# EAGLE design superDuino1 (EAGLE 7.1.0)
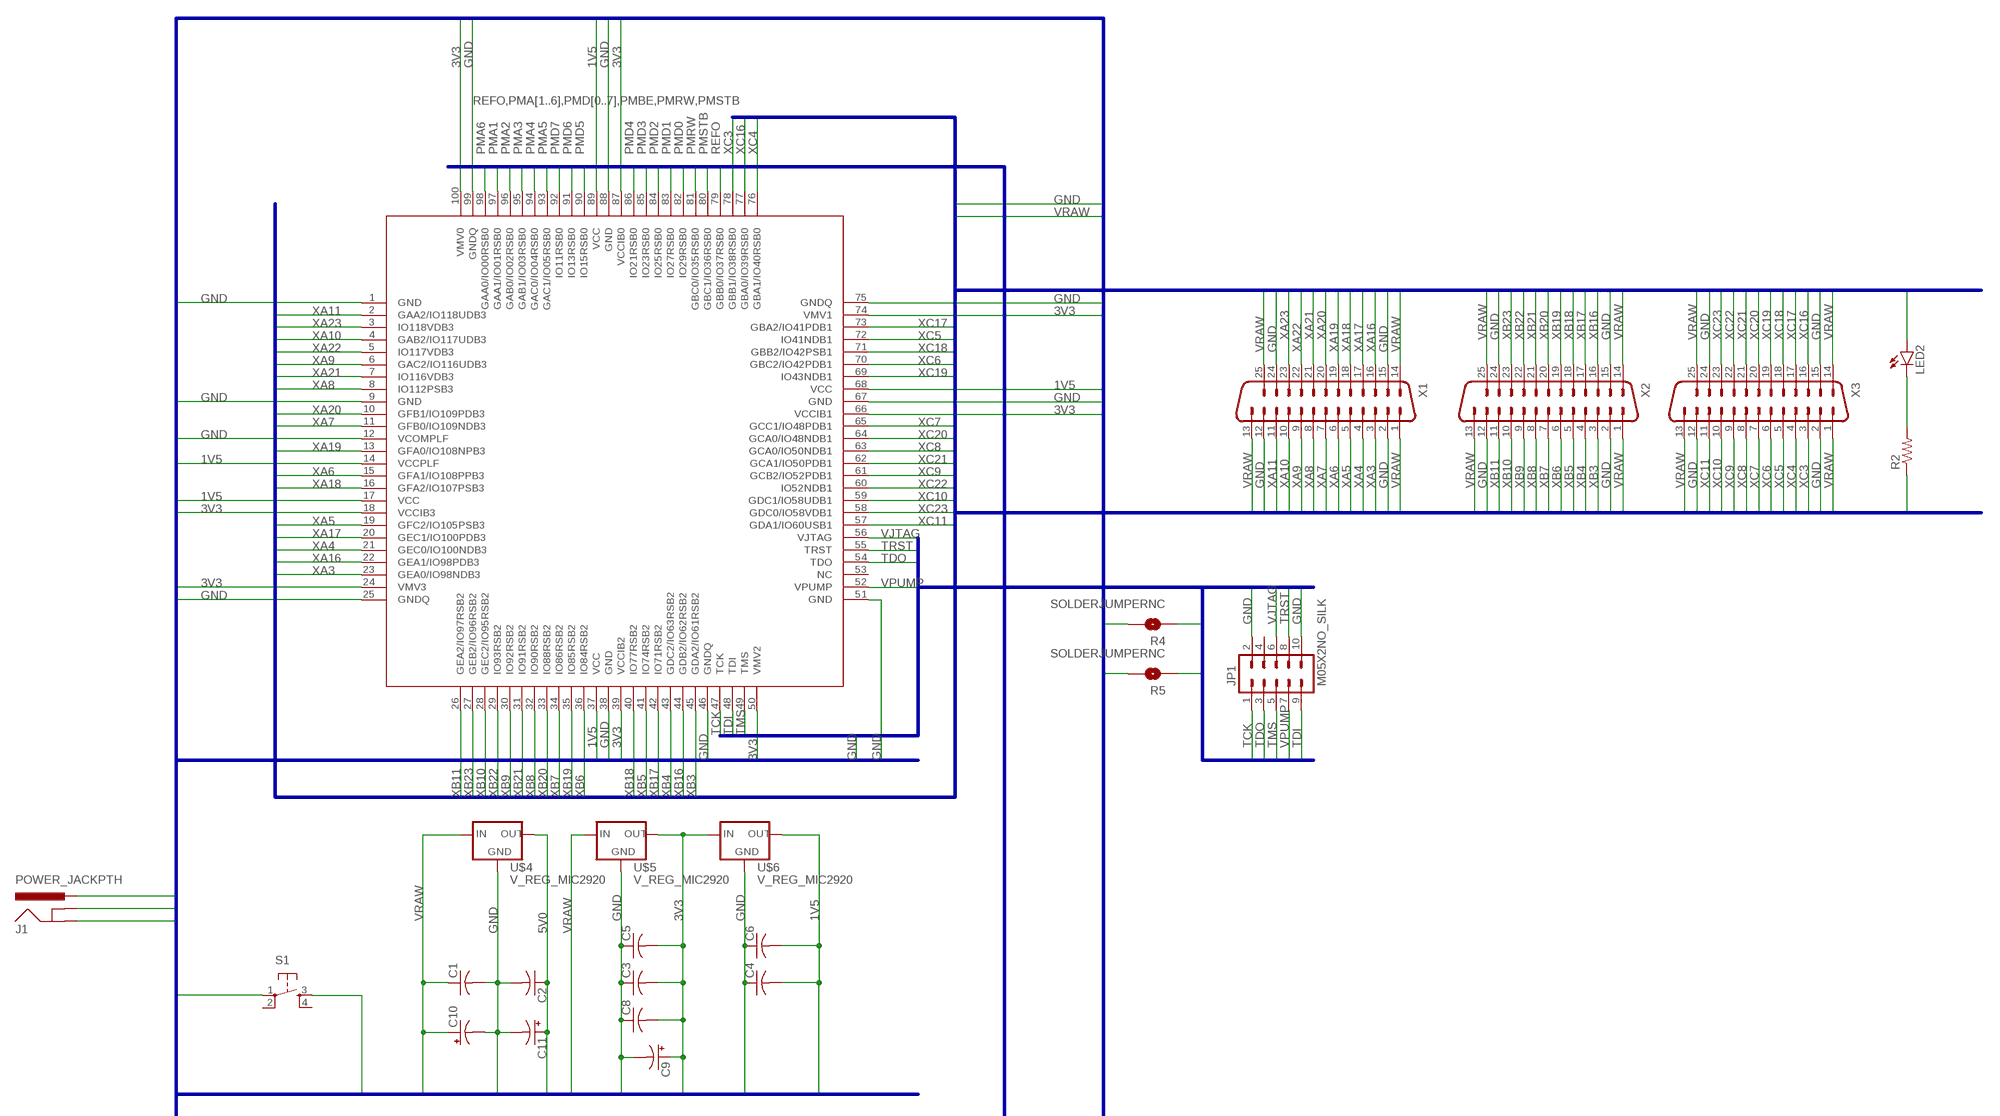
[diagram p0: schematic, sheet 1, part 1 of 2]
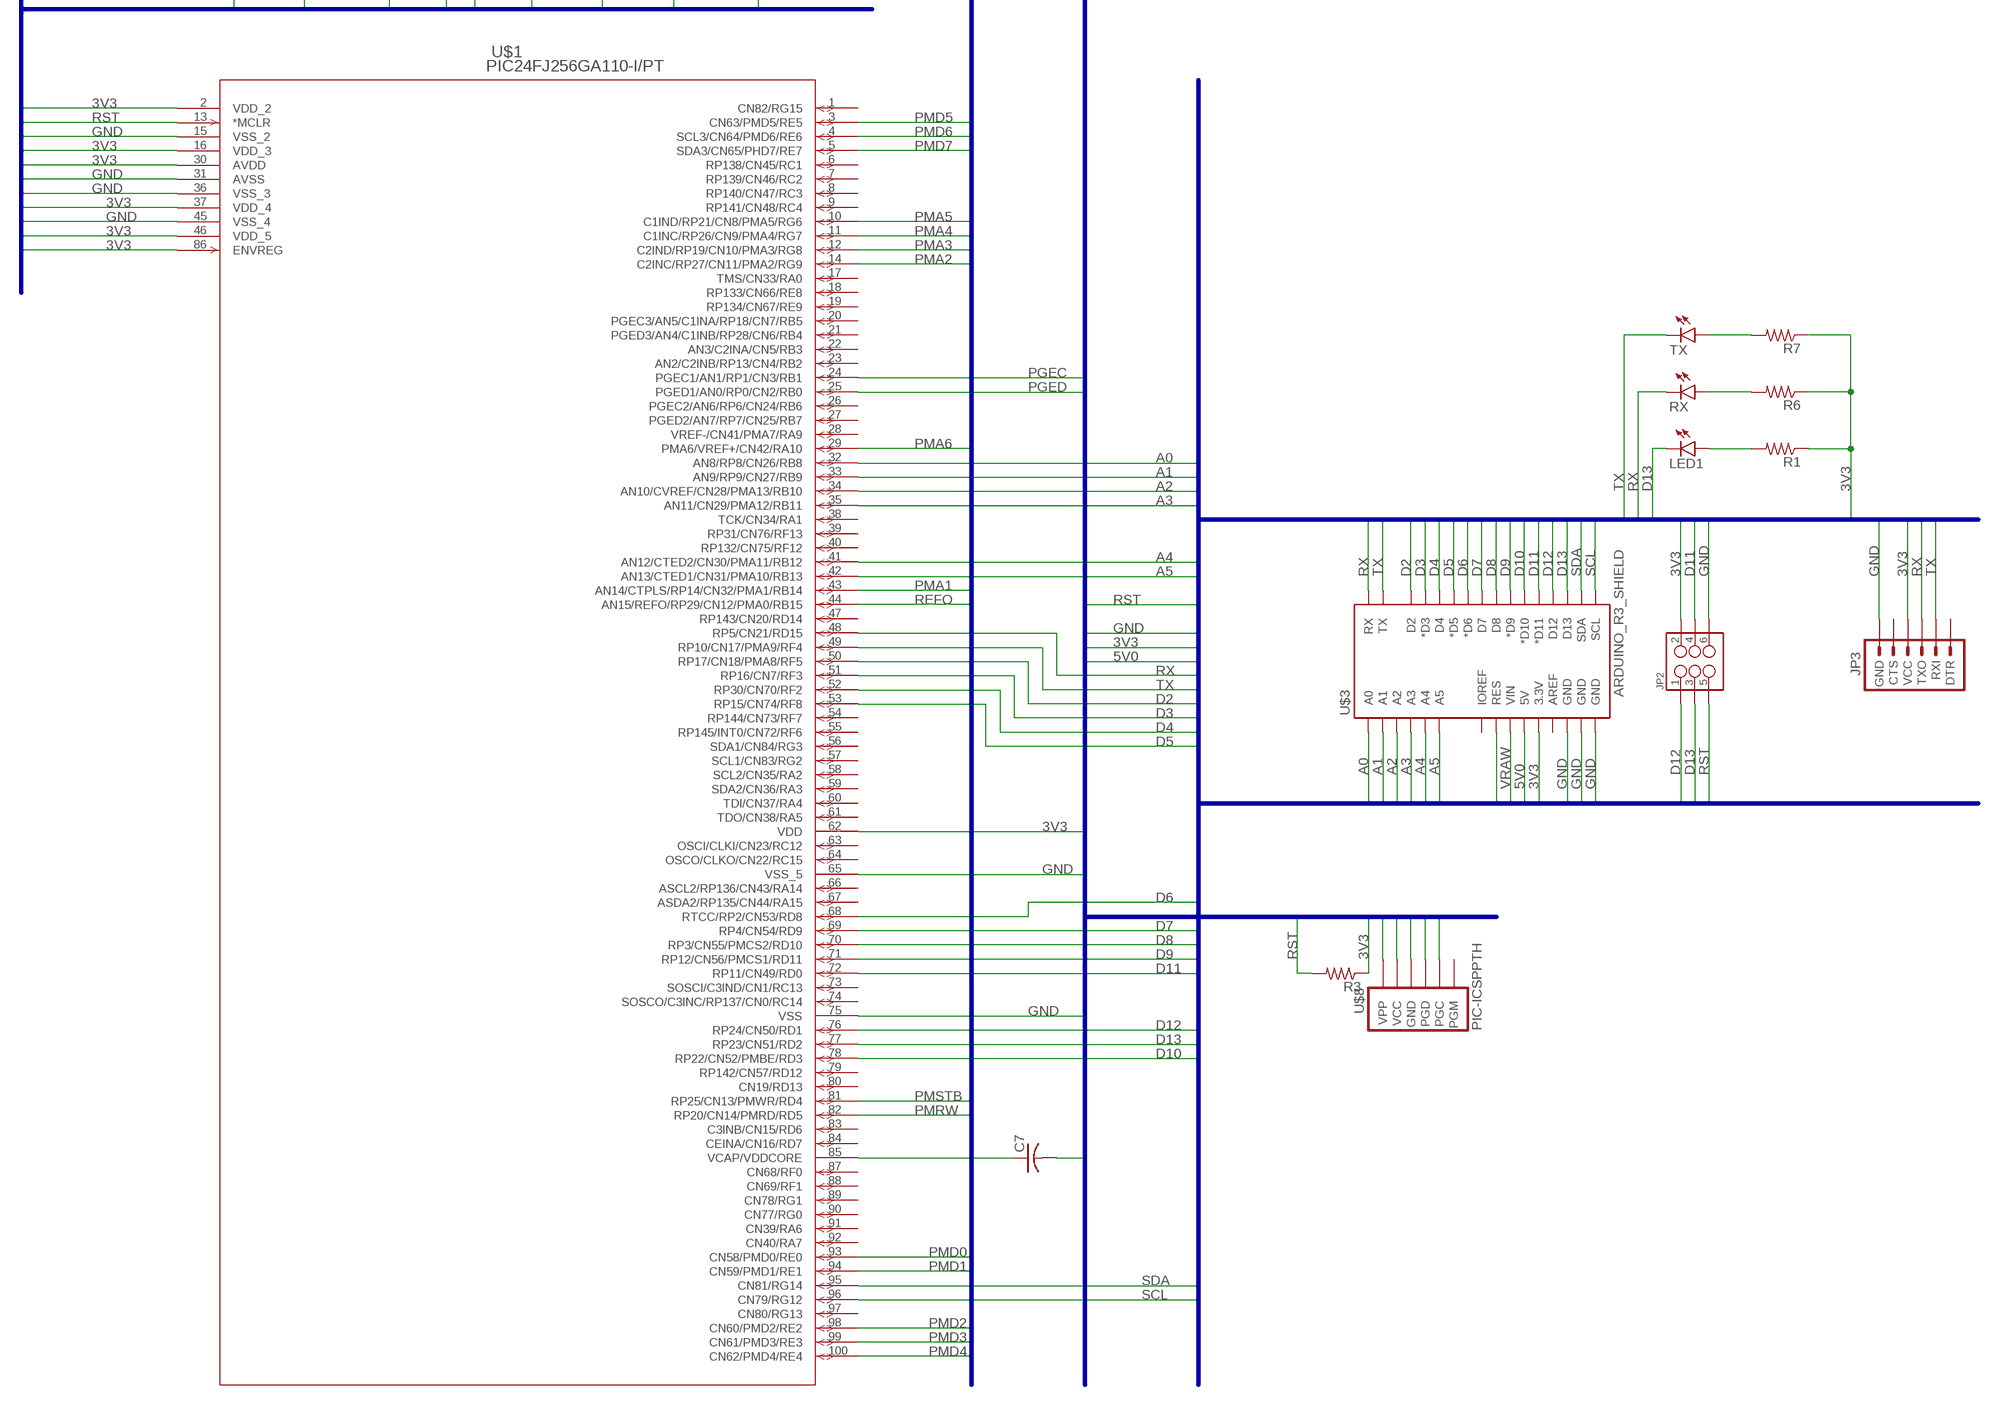
[diagram p1: schematic, sheet 1, part 2 of 2]

## Parts
C1  C-USC0805  [C0805]
C2  C-USC0805  [C0805]
C3  C-USC0805  [C0805]
C4  C-USC0805  [C0805]
C5  C-USC0805  [C0805]
C6  C-USC0805  [C0805]
C7  C-US050-035X075  [C050-035X075]
C8  C-USC0805  [C0805]
C9  CPOL-USE2.5-6  [E2,5-6]
C10  CPOL-USE2.5-6  [E2,5-6]
C11  CPOL-USE2.5-6  [E2,5-6]
J1  POWER_JACKPTH  [POWER_JACK_PTH]
JP1  M05X2NO_SILK  [2X5_NOSILK]
JP2  M03X22X3_SILK_SM  [2X3]
JP3  ARDUINO_SERIAL_PROGRAMPTH  [1X06]
LED1  LED1206  [LED-1206]
LED2  LED1206  [LED-1206]
R1  R-US_R0805  [R0805]
R2  R-US_R0805  [R0805]
R3  R-US_R0805  [R0805]
R4  SOLDERJUMPERNC  [SJ_2S]
R5  SOLDERJUMPERNC  [SJ_2S]
R6  R-US_R0805  [R0805]
R7  R-US_R0805  [R0805]
RX  LED1206  [LED-1206]
S1  TAC_SWITCHPTH  [TACTILE-PTH]
TX  LED1206  [LED-1206]
U$1  PIC24FJ256GA110-I/PT  [TQFP100_12X12MC]
U$2  A3P250-VQ100  [VQ100]
U$3  ARDUINO_R3_SHIELD  [UNO_R3_SHIELD]
U$4  V_REG_MIC2920  [SOT223]
U$5  V_REG_MIC2920  [SOT223]
U$6  V_REG_MIC2920  [SOT223]
U$8  PIC-ICSPPTH  [MOLEX-1X6]
X1  DB25H  [M25H]
X2  DB25H  [M25H]
X3  DB25H  [M25H]

## Nets
1V5: C4.2 C6.2 U$2.14(VCCPLF) U$2.17(VCC) U$2.37(VCC) U$2.68(VCC) U$2.89(VCC) U$6.3(OUT)
3V3: C3.2 C5.2 C8.2 C9.+ JP2.2 JP3.VCC R1.1 R3.1 R4.2 R5.2 R6.1 R7.1 U$1.2(VDD_2) U$1.16(VDD_3) U$1.30(AVDD) U$1.37(VDD_4) U$1.46(VDD_5) U$1.62(VDD) U$1.86(ENVREG) U$2.18(VCCIB3) U$2.24(VMV3) U$2.39(VCCIB2) U$2.50(VMV2) U$2.66(VCCIB1) U$2.74(VMV1) U$2.87(VCCIB0) U$2.100(VMV0) U$3.3.3V U$5.3(OUT) U$6.1(IN) U$8.5(VCC)
5V0: C2.1 C11.+ U$3.5V U$4.3(OUT)
A0: U$1.32(AN8/RP8/CN26/RB8) U$3.A0
A1: U$1.33(AN9/RP9/CN27/RB9) U$3.A1
A2: U$1.34(AN10/CVREF/CN28/PMA13/RB10) U$3.A2
A3: U$1.35(AN11/CN29/PMA12/RB11) U$3.A3
A4: U$1.41(AN12/CTED2/CN30/PMA11/RB12) U$3.A4
A5: U$1.42(AN13/CTED1/CN31/PMA10/RB13) U$3.A5
D2: U$1.50(RP17/CN18/PMA8/RF5) U$3.D2
D3: U$1.51(RP16/CN7/RF3) U$3.D3(*D3)
D4: U$1.52(RP30/CN70/RF2) U$3.D4
D5: U$1.53(RP15/CN74/RF8) U$3.D5(*D5)
D6: U$1.68(RTCC/RP2/CN53/RD8) U$3.D6(*D6)
D7: U$1.69(RP4/CN54/RD9) U$3.D7
D8: U$1.70(RP3/CN55/PMCS2/RD10) U$3.D8
D9: U$1.71(RP12/CN56/PMCS1/RD11) U$3.D9(*D9)
D10: U$1.78(RP22/CN52/PMBE/RD3) U$3.D10(*D10)
D11: JP2.4 U$1.72(RP11/CN49/RD0) U$3.D11(*D11)
D12: JP2.1 U$1.76(RP24/CN50/RD1) U$3.D12
D13: JP2.3 LED1.C U$1.77(RP23/CN51/RD2) U$3.D13
GND: C1.2 C2.2 C3.1 C4.1 C5.1 C6.1 C7.2 C8.1 C9.- C10.- C11.- J1.GND J1.GNDBREAK JP1.2 JP1.10 JP2.6 JP3.GND R2.1 S1.1 U$1.15(VSS_2) U$1.31(AVSS) U$1.36(VSS_3) U$1.45(VSS_4) U$1.65(VSS_5) U$1.75(VSS) U$2.1(GND) U$2.9(GND) U$2.12(VCOMPLF) U$2.25(GNDQ) U$2.38(GND) U$2.46(GNDQ) U$2.51(GND) U$2.67(GND) U$2.75(GNDQ) U$2.88(GND) U$2.99(GNDQ) U$3.GND@0(GND) U$3.GND@1(GND) U$3.GND@2(GND) U$4.2(GND) U$5.2(GND) U$6.2(GND) U$8.4(GND) X1.2 X1.12 X1.15 X1.24 X2.2 X2.12 X2.15 X2.24 X3.2 X3.12 X3.15 X3.24
N$1: LED1.A R1.2
N$2: C7.1 U$1.85(VCAP/VDDCORE)
N$3: LED2.C R2.2
N$4: R7.2 TX.A
N$5: R6.2 RX.A
PGEC: U$1.24(PGEC1/AN1/RP1/CN3/RB1) U$8.2(PGC)
PGED: U$1.25(PGED1/AN0/RP0/CN2/RB0) U$8.3(PGD)
PMA1: U$1.43(AN14/CTPLS/RP14/CN32/PMA1/RB14) U$2.97(GAA1/IO01RSB0)
PMA2: U$1.14(C2INC/RP27/CN11/PMA2/RG9) U$2.96(GAB0/IO02RSB0)
PMA3: U$1.12(C2IND/RP19/CN10/PMA3/RG8) U$2.95(GAB1/IO03RSB0)
PMA4: U$1.11(C1INC/RP26/CN9/PMA4/RG7) U$2.94(GAC0/IO04RSB0)
PMA5: U$1.10(C1IND/RP21/CN8/PMA5/RG6) U$2.93(GAC1/IO05RSB0)
PMA6: U$1.29(PMA6/VREF+/CN42/RA10) U$2.98(GAA0/IO00RSB0)
PMD0: U$1.93(CN58/PMD0/RE0) U$2.82(IO29RSB0)
PMD1: U$1.94(CN59/PMD1/RE1) U$2.83(IO27RSB0)
PMD2: U$1.98(CN60/PMD2/RE2) U$2.84(IO25RSB0)
PMD3: U$1.99(CN61/PMD3/RE3) U$2.85(IO23RSB0)
PMD4: U$1.100(CN62/PMD4/RE4) U$2.86(IO21RSB0)
PMD5: U$1.3(CN63/PMD5/RE5) U$2.90(IO15RSB0)
PMD6: U$1.4(SCL3/CN64/PMD6/RE6) U$2.91(IO13RSB0)
PMD7: U$1.5(SDA3/CN65/PHD7/RE7) U$2.92(IO11RSB0)
PMRW: U$1.82(RP20/CN14/PMRD/RD5) U$2.81(GBC0/IO35RSB0)
PMSTB: U$1.81(RP25/CN13/PMWR/RD4) U$2.80(GBC1/IO36RSB0)
REFO: U$1.44(AN15/REFO/RP29/CN12/PMA0/RB15) U$2.79(GBB0/IO37RSB0)
RST: JP2.5 R3.2 S1.3 U$1.13(*MCLR) U$3.RES U$8.6(VPP)
RX: JP3.TXO RX.C U$1.48(RP5/CN21/RD15) U$3.RX
SCL: U$1.96(CN79/RG12) U$3.SCL
SDA: U$1.95(CN81/RG14) U$3.SDA
TCK: JP1.1 U$2.47(TCK)
TDI: JP1.9 U$2.48(TDI)
TDO: JP1.3 U$2.54(TDO)
TMS: JP1.5 U$2.49(TMS)
TRST: JP1.8 U$2.55(TRST)
TX: JP3.RXI TX.C U$1.49(RP10/CN17/PMA9/RF4) U$3.TX
VJTAG: JP1.6 R5.1 U$2.56(VJTAG)
VPUMP: JP1.7 R4.1 U$2.52(VPUMP)
VRAW: C1.1 C10.+ J1.PWR U$3.VIN U$4.1(IN) U$5.1(IN) X1.1 X1.13 X1.14 X1.25 X2.1 X2.13 X2.14 X2.25 X3.1 X3.13 X3.14 X3.25
XA3: U$2.23(GEA0/IO98NDB3) X1.3
XA4: U$2.21(GEC0/IO100NDB3) X1.4
XA5: U$2.19(GFC2/IO105PSB3) X1.5
XA6: U$2.15(GFA1/IO108PPB3) X1.6
XA7: U$2.11(GFB0/IO109NDB3) X1.7
XA8: U$2.8(IO112PSB3) X1.8
XA9: U$2.6(GAC2/IO116UDB3) X1.9
XA10: U$2.4(GAB2/IO117UDB3) X1.10
XA11: U$2.2(GAA2/IO118UDB3) X1.11
XA16: U$2.22(GEA1/IO98PDB3) X1.16
XA17: U$2.20(GEC1/IO100PDB3) X1.17
XA18: U$2.16(GFA2/IO107PSB3) X1.18
XA19: U$2.13(GFA0/IO108NPB3) X1.19
XA20: U$2.10(GFB1/IO109PDB3) X1.20
XA21: U$2.7(IO116VDB3) X1.21
XA22: U$2.5(IO117VDB3) X1.22
XA23: U$2.3(IO118VDB3) X1.23
XB3: U$2.45(GDA2/IO61RSB2) X2.3
XB4: U$2.43(GDC2/IO63RSB2) X2.4
XB5: U$2.41(IO74RSB2) X2.5
XB6: U$2.36(IO84RSB2) X2.6
XB7: U$2.34(IO86RSB2) X2.7
XB8: U$2.32(IO90RSB2) X2.8
XB9: U$2.30(IO92RSB2) X2.9
XB10: U$2.28(GEC2/IO95RSB2) X2.10
XB11: U$2.26(GEA2/IO97RSB2) X2.11
XB16: U$2.44(GDB2/IO62RSB2) X2.16
XB17: U$2.42(IO71RSB2) X2.17
XB18: U$2.40(IO77RSB2) X2.18
XB19: U$2.35(IO85RSB2) X2.19
XB20: U$2.33(IO88RSB2) X2.20
XB21: LED2.A U$2.31(IO91RSB2) X2.21
XB22: U$2.29(IO93RSB2) X2.22
XB23: U$2.27(GEB2/IO96RSB2) X2.23
XC3: U$2.78(GBB1/IO38RSB0) X3.3
XC4: U$2.76(GBA1/IO40RSB0) X3.4
XC5: U$2.72(IO41NDB1) X3.5
XC6: U$2.70(GBC2/IO42PDB1) X3.6
XC7: U$2.65(GCC1/IO48PDB1) X3.7
XC8: U$2.63(GCA0/IO50NDB1) X3.8
XC9: U$2.61(GCB2/IO52PDB1) X3.9
XC10: U$2.59(GDC1/IO58UDB1) X3.10
XC11: U$2.57(GDA1/IO60USB1) X3.11
XC16: U$2.77(GBA0/IO39RSB0) X3.16
XC17: U$2.73(GBA2/IO41PDB1) X3.17
XC18: U$2.71(GBB2/IO42PSB1) X3.18
XC19: U$2.69(IO43NDB1) X3.19
XC20: U$2.64(GCA0/IO48NDB1) X3.20
XC21: U$2.62(GCA1/IO50PDB1) X3.21
XC22: U$2.60(IO52NDB1) X3.22
XC23: U$2.58(GDC0/IO58VDB1) X3.23
Unconnected: JP1.4 JP3.CTS JP3.DTR S1.2 S1.4 U$1.1(CN82/RG15) U$1.6(RP138/CN45/RC1) U$1.7(RP139/CN46/RC2) U$1.8(RP140/CN47/RC3) U$1.9(RP141/CN48/RC4) U$1.17(TMS/CN33/RA0) U$1.18(RP133/CN66/RE8) U$1.19(RP134/CN67/RE9) U$1.20(PGEC3/AN5/C1INA/RP18/CN7/RB5) U$1.21(PGED3/AN4/C1INB/RP28/CN6/RB4) U$1.22(AN3/C2INA/CN5/RB3) U$1.23(AN2/C2INB/RP13/CN4/RB2) U$1.26(PGEC2/AN6/RP6/CN24/RB6) U$1.27(PGED2/AN7/RP7/CN25/RB7) U$1.28(VREF-/CN41/PMA7/RA9) U$1.38(TCK/CN34/RA1) U$1.39(RP31/CN76/RF13) U$1.40(RP132/CN75/RF12) U$1.47(RP143/CN20/RD14) U$1.54(RP144/CN73/RF7) U$1.55(RP145/INT0/CN72/RF6) U$1.56(SDA1/CN84/RG3) U$1.57(SCL1/CN83/RG2) U$1.58(SCL2/CN35/RA2) U$1.59(SDA2/CN36/RA3) U$1.60(TDI/CN37/RA4) U$1.61(TDO/CN38/RA5) U$1.63(OSCI/CLKI/CN23/RC12) U$1.64(OSCO/CLKO/CN22/RC15) U$1.66(ASCL2/RP136/CN43/RA14) U$1.67(ASDA2/RP135/CN44/RA15) U$1.73(SOSCI/C3IND/CN1/RC13) U$1.74(SOSCO/C3INC/RP137/CN0/RC14) U$1.79(RP142/CN57/RD12) U$1.80(CN19/RD13) U$1.83(C3INB/CN15/RD6) U$1.84(CEINA/CN16/RD7) U$1.87(CN68/RF0) U$1.88(CN69/RF1) U$1.89(CN78/RG1) U$1.90(CN77/RG0) U$1.91(CN39/RA6) U$1.92(CN40/RA7) U$1.97(CN80/RG13) U$2.53(NC) U$3.AREF U$3.IOREF U$8.1(PGM)

## Buses
REFO,PMA[1..6],PMD[0..7],PMBE,PMRW,PMSTB
PGEC,PGED,GND,VRAW,5V0,3V3,1V5,RST
TX,RX,D[2..13],A[0..5],VRAW,5V0,3V3,GND,RST,SDA,SCL
TCK,TDO,TMS,VPUMP,TDI,GND,VJTAG,TRST
GND,VRAW,XA[3..11],XA[16..23],XB[3..11],XB[16..23],XC[3..11],XC[16..23]

## Library data of the parts
C1-C8 = rcl:C-US: CAPACITOR, American symbol
C9-C11 = rcl:CPOL-US: POLARIZED CAPACITOR, American symbol
J1 = SparkFun-Connectors:POWER_JACK: Power Jack This is the standard 5.5mm barrel jack for power. The PTH is the most common, proven, reliable, footprint. The Slot footprint only works if the mill layer is transmitted to the PCB fab house so be warned. Mating wall wart : TOL-00298 (and others); PROD_ID: PRT-00119
JP1 = SparkFun-Connectors:M05X2: Header 5x2 Standard 10-pin dual row 0.1" header. Commonly used with AVR-ISP. Use with Spark Fun Electronics SKU: PRT-00778
JP2 = SparkFun-Connectors:M03X2: 2x3 .1" header. Shrouded, with keying- CONN-10681 SMT- CONN-11415 Pogo pins- HW-11044
JP3 = SparkFun-Connectors:ARDUINO_SERIAL_PROGRAM: FTDI connector footprints
LED1 LED2 RX TX = SparkFun-LED:LED: LEDs Standard schematic elements and footprints for 5mm, 3mm, 1206, and 0603 sized LEDs. 5mm - Spark Fun Electronics SKU : COM-00529 (and others)
R1-R3 R6 R7 = rcl:R-US_: RESISTOR, American symbol
R4 R5 = SparkFun-Retired:SOLDERJUMPER: Solder Jumper Standard SMD solder jumper. Used to automate production. Two varients : Normally Open and Normally Closed are the same, but have different paste layers. NC will have a large amount of paste and should jumper during reflow.
S1 = SparkFun-Electromechanical:TAC_SWITCH: Momentary Switch Button commonly used for reset or general input. Spark Fun Electronics SKU : COM-00097 SMT- SWCH-08247
U$1 = pic24fj256ga110:PIC24FJ256GA110-I/PT; COPYRIGHT: Copyright (C) 2015 Accelerated Designs. All rights reserved; MANUFACTURER_PART_NUMBER: PIC24FJ256GA110-I/PT; VENDOR: Microchip
U$2 = microsemi-a3p250:A3P250-VQ100
U$3 = SparkFun-Boards:ARDUINO_R3_SHIELD: Shield form compatible with the Arduino Uno R3.
U$4-U$6 = SparkFun-PowerIC:V_REG_MIC2920: MIC2920A (http://www.micrel.com/_PDF/mic2920.pdf) - 400mA output LDO Regulator
U$8 = SparkFun-Connectors:PIC-ICSP: ISCP Programming connector for UAV, UBW Kit, etc.
X1-X3 = SparkFun-Connectors:DB25: Various DB25 connectors

## Board
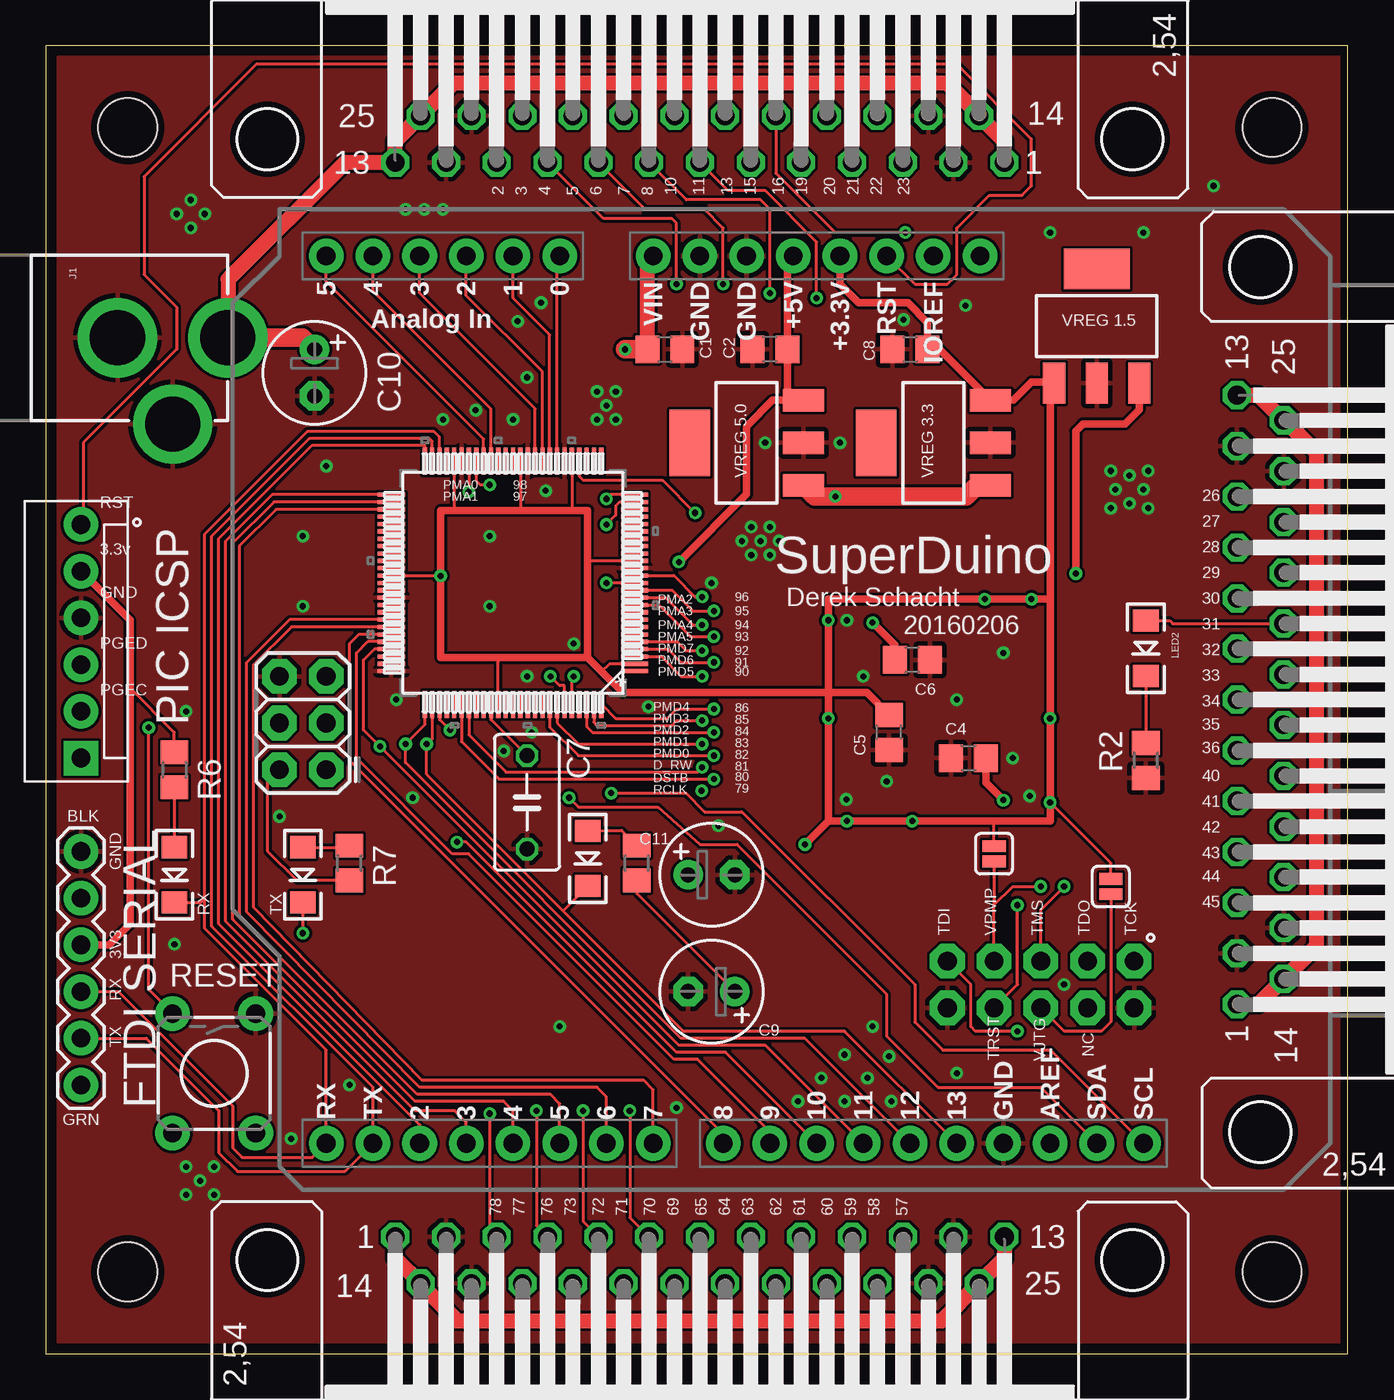
[diagram p2: board, top side]
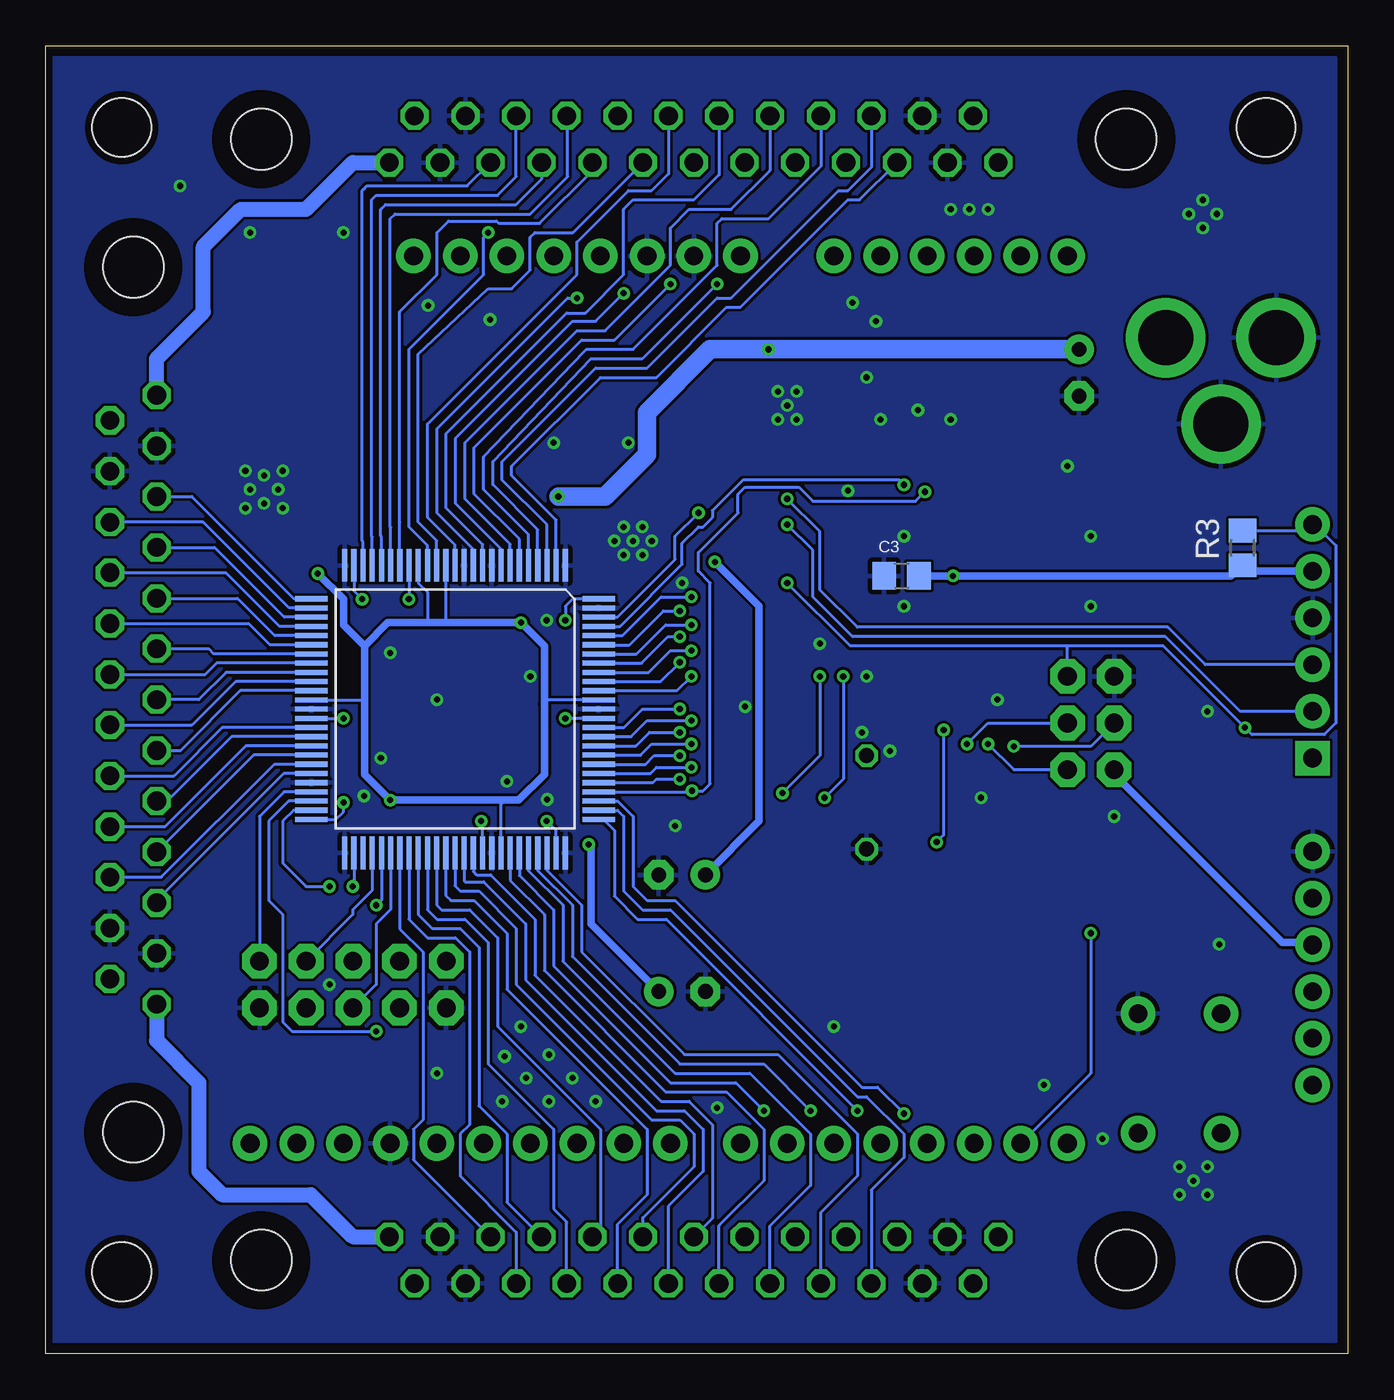
[diagram p3: board, bottom side, seen from below]

Size 70.79 x 71.11 mm. Coordinates in mm from the lower left corner, seen from the top.
Outline: 0,0 70.79,0 70.79,71.11 0,71.11 0,0
Copper layers (1*16): Top 0.0356mm / dielectric 1.5011mm / Bottom 0.0356mm
Design rules "LaenPCBOrder": minimum track width 6mil, minimum drill 13mil, track to track 6mil, track to pad 6mil, pad to pad 6mil, via to via 6mil, smd to smd 6mil, copper to edge 15mil, drill to drill 6mil, minimum pad ring 7mil, minimum via ring 7mil, stop-mask expansion 3mil, vias tented up to drill 0mil, thermal gap 10mil
Holes 3.2 mm at 4.45,66.67 66.67,66.67 66.67,4.45 4.45,4.45

### Footprints (pad centres in the part's own frame; a part is rotated, then mirrored left to right if it is on the bottom)
C0805 = smd 1.3 x 1.5: 1 -0.95,0; 2 0.95,0
C050-035X075 = drill 0.813 octagon: 1 -2.54,0; 2 2.54,0
E2,5-6 = drill 0.813 pad 1.6: + -1.27,0 | drill 0.813 pad 1.6 octagon: - 1.27,0
POWER_JACK_PTH = drill 2.997 pad 4.318: GND 0,7.7; GNDBREAK 4.7,10.7; PWR 0,13.7
2X5_NOSILK = drill 1.016 pad 1.88 octagon: 1 -1.27,5.08; 2 1.27,5.08; 3 -1.27,2.54; 4 1.27,2.54; 5 -1.27,0; 6 1.27,0; 7 -1.27,-2.54; 8 1.27,-2.54; 9 -1.27,-5.08; 10 1.27,-5.08
2X3 = drill 1.016 pad 1.88 octagon: 1 0,0; 2 0,2.54; 3 2.54,0; 4 2.54,2.54; 5 5.08,0; 6 5.08,2.54
1X06 = drill 1.016 pad 1.88: CTS 10.16,0; DTR 0,0; GND 12.7,0; RXI 2.54,0; TXO 5.08,0; VCC 7.62,0
LED-1206 = smd 1.2 x 1.4: A -1.5,0; C 1.5,0
R0805 = smd 1.3 x 1.5: 1 -0.95,0; 2 0.95,0
SJ_2S = smd 0.635 x 1.27: 1 -0.412,0; 2 0.412,0
TACTILE-PTH = drill 1.016 pad 1.88: 1 -3.251,2.261; 2 3.251,2.261; 3 -3.251,-2.261; 4 3.251,-2.261
TQFP100_12X12MC = smd 1.473 x 0.229: 1 -6.617,4.8; 2 -6.617,4.4; 3 -6.617,4; 4 -6.617,3.6; 5 -6.617,3.2; 6 -6.617,2.8; 7 -6.617,2.4; 8 -6.617,2; 9 -6.617,1.6; 10 -6.617,1.2; 11 -6.617,0.8; 12 -6.617,0.4; 13 -6.617,0; 14 -6.617,-0.4; 15 -6.617,-0.8; 16 -6.617,-1.2; 17 -6.617,-1.6; 18 -6.617,-2; 19 -6.617,-2.4; 20 -6.617,-2.8; 21 -6.617,-3.2; 22 -6.617,-3.6; 23 -6.617,-4; 24 -6.617,-4.4; 25 -6.617,-4.8; 51 6.617,-4.8; 52 6.617,-4.4; 53 6.617,-4; 54 6.617,-3.6; 55 6.617,-3.2; 56 6.617,-2.8; 57 6.617,-2.4; 58 6.617,-2; 59 6.617,-1.6; 60 6.617,-1.2; 61 6.617,-0.8; 62 6.617,-0.4; 63 6.617,0; 64 6.617,0.4; 65 6.617,0.8; 66 6.617,1.2; 67 6.617,1.6; 68 6.617,2; 69 6.617,2.4; 70 6.617,2.8; 71 6.617,3.2; 72 6.617,3.6; 73 6.617,4; 74 6.617,4.4; 75 6.617,4.8 | smd 0.229 x 1.473: 26 -4.8,-6.617; 27 -4.4,-6.617; 28 -4,-6.617; 29 -3.6,-6.617; 30 -3.2,-6.617; 31 -2.8,-6.617; 32 -2.4,-6.617; 33 -2,-6.617; 34 -1.6,-6.617; 35 -1.2,-6.617; 36 -0.8,-6.617; 37 -0.4,-6.617; 38 0,-6.617; 39 0.4,-6.617; 40 0.8,-6.617; 41 1.2,-6.617; 42 1.6,-6.617; 43 2,-6.617; 44 2.4,-6.617; 45 2.8,-6.617; 46 3.2,-6.617; 47 3.6,-6.617; 48 4,-6.617; 49 4.4,-6.617; 50 4.8,-6.617; 76 4.8,6.617; 77 4.4,6.617; 78 4,6.617; 79 3.6,6.617; 80 3.2,6.617; 81 2.8,6.617; 82 2.4,6.617; 83 2,6.617; 84 1.6,6.617; 85 1.2,6.617; 86 0.8,6.617; 87 0.4,6.617; 88 0,6.617; 89 -0.4,6.617; 90 -0.8,6.617; 91 -1.2,6.617; 92 -1.6,6.617; 93 -2,6.617; 94 -2.4,6.617; 95 -2.8,6.617; 96 -3.2,6.617; 97 -3.6,6.617; 98 -4,6.617; 99 -4.4,6.617; 100 -4.8,6.617
VQ100 = smd 1.778 x 0.279: 1 -0.318,0; 2 -0.318,-0.5; 3 -0.318,-1; 4 -0.318,-1.5; 5 -0.318,-2; 6 -0.318,-2.5; 7 -0.318,-3; 8 -0.318,-3.5; 9 -0.318,-4; 10 -0.318,-4.5; 11 -0.318,-5; 12 -0.318,-5.5; 13 -0.318,-6; 14 -0.318,-6.5; 15 -0.318,-7; 16 -0.318,-7.5; 17 -0.318,-8; 18 -0.318,-8.5; 19 -0.318,-9; 20 -0.318,-9.5; 21 -0.318,-10; 22 -0.318,-10.5; 23 -0.318,-11; 24 -0.318,-11.5; 25 -0.318,-12; 51 15.318,-12; 52 15.318,-11.5; 53 15.318,-11; 54 15.318,-10.5; 55 15.318,-10; 56 15.318,-9.5; 57 15.318,-9; 58 15.318,-8.5; 59 15.318,-8; 60 15.318,-7.5; 61 15.318,-7; 62 15.318,-6.5; 63 15.318,-6; 64 15.318,-5.5; 65 15.318,-5; 66 15.318,-4.5; 67 15.318,-4; 68 15.318,-3.5; 69 15.318,-3; 70 15.318,-2.5; 71 15.318,-2; 72 15.318,-1.5; 73 15.318,-1; 74 15.318,-0.5; 75 15.318,0 | smd 0.279 x 1.778: 26 1.5,-13.818; 27 2,-13.818; 28 2.5,-13.818; 29 3,-13.818; 30 3.5,-13.818; 31 4,-13.818; 32 4.5,-13.818; 33 5,-13.818; 34 5.5,-13.818; 35 6,-13.818; 36 6.5,-13.818; 37 7,-13.818; 38 7.5,-13.818; 39 8,-13.818; 40 8.5,-13.818; 41 9,-13.818; 42 9.5,-13.818; 43 10,-13.818; 44 10.5,-13.818; 45 11,-13.818; 46 11.5,-13.818; 47 12,-13.818; 48 12.5,-13.818; 49 13,-13.818; 50 13.5,-13.818; 76 13.5,1.817; 77 13,1.817; 78 12.5,1.817; 79 12,1.817; 80 11.5,1.817; 81 11,1.817; 82 10.5,1.817; 83 10,1.817; 84 9.5,1.817; 85 9,1.817; 86 8.5,1.817; 87 8,1.817; 88 7.5,1.817; 89 7,1.817; 90 6.5,1.817; 91 6,1.817; 92 5.5,1.817; 93 5,1.817; 94 4.5,1.817; 95 4,1.817; 96 3.5,1.817; 97 3,1.817; 98 2.5,1.817; 99 2,1.817; 100 1.5,1.817
UNO_R3_SHIELD = drill 1.016 pad 1.88: 3.3V 50.8,26.67; 5V 50.8,29.21; A0 50.8,41.91; A1 50.8,44.45; A2 50.8,46.99; A3 50.8,49.53; A4 50.8,52.07; A5 50.8,54.61; AREF 2.54,15.24; D2 2.54,49.53; D3 2.54,46.99; D4 2.54,44.45; D5 2.54,41.91; D6 2.54,39.37; D7 2.54,36.83; D8 2.54,33.02; D9 2.54,30.48; D10 2.54,27.94; D11 2.54,25.4; D12 2.54,22.86; D13 2.54,20.32; GND@0 50.8,31.75; GND@1 50.8,34.29; GND@2 2.54,17.78; IOREF 50.8,21.59; NC 50.8,19.05; RES 50.8,24.13; RX 2.54,54.61; SCL 2.54,10.16; SDA 2.54,12.7; TX 2.54,52.07; VIN 50.8,36.83
SOT223 = smd 1.219 x 2.235: 1 -2.311,-3.099; 2 0,-3.099; 3 2.311,-3.099 | smd 3.6 x 2.2: 4 0,3.099
MOLEX-1X6 = drill 1.016 pad 1.88 square: 1 0,0 | drill 1.016 pad 1.88: 2 2.54,0; 3 5.08,0; 4 7.62,0; 5 10.16,0; 6 12.7,0
M25H = drill 1.016 octagon: 1 -16.561,1.27; 2 -13.792,1.27; 3 -11.049,1.27; 4 -8.28,1.27; 5 -5.512,1.27; 6 -2.769,1.27; 7 0,1.27; 8 2.769,1.27; 9 5.512,1.27; 10 8.28,1.27; 11 11.049,1.27; 12 13.792,1.27; 13 16.561,1.27; 14 -15.189,-1.27; 15 -12.421,-1.27; 16 -9.652,-1.27; 17 -6.909,-1.27; 18 -4.14,-1.27; 19 -1.372,-1.27; 20 1.372,-1.27; 21 4.14,-1.27; 22 6.909,-1.27; 23 9.652,-1.27; 24 12.421,-1.27; 25 15.189,-1.27 | hole 3.302: 23.52,0; -23.52,0

### Placement (x,y rotation side)
C1  33.66,54.61 0 top
C2  39.37,54.61 180 top
C3  24.26,42.29 0 bottom
C4  50.16,32.38 0 top
C5  45.85,33.78 90 top
C6  47.12,37.72 180 top
C7  26.16,29.97 270 top
C8  46.99,54.61 0 top
C9  36.2,19.68 180 top
C10  14.61,53.34 270 top
C11  36.2,26.04 0 top
J1  -3.81,55.24 270 top
JP1  54.1,20.07 270 top
JP2  15.24,31.75 90 top
JP3  1.91,14.61 90 top
LED1  29.46,26.92 270 top
LED2  59.82,38.35 270 top
R1  32.13,26.67 90 top
R2  59.82,32.26 90 top
R3  5.71,43.81 90 bottom
R4  51.56,27.18 90 top
R5  57.91,25.4 90 top
R6  6.99,31.75 270 top
R7  16.51,26.67 90 top
RX  6.99,26.04 270 top
S1  9.14,15.24 270 top
TX  13.97,26.04 270 top
U$1  25.4,41.91 180 top
U$2  42.55,42.55 270 bottom
U$3  69.85,8.89 90 top
U$4  38.1,49.53 90 top
U$5  48.26,49.53 90 top
U$6  57.15,55.88 0 top
U$8  1.91,32.38 90 top
X1  35.56,66.04 180 top
X2  66.04,35.56 90 top
X3  35.56,5.08 0 top

### Tracks (layer width: path | path; a pad name or v marks a point on that pad's centre or on a via)
1V5  (via drill 0.33)
  Top 0.406: C6.2 46.17,38.54 v44.96,39.75 | C4.2 51.12,31.05 v52.07,30.1 | U$6.3 59.46,51.33 58.67,50.55 56.39,50.55 56.01,50.16 v56.01,42.42
  Bottom 0.152: U$2.14 49.05,39.77 49.02,39.75 | U$2.37 53.58,35.55 53.47,35.43 | U$2.89 43.45,35.55 43.69,35.31 | U$2.68 46.05,29.9 45.85,30.1 | U$2.17 50.55,41.91 50.04,41.4 50.04,39.88 50.16,39.75
  Bottom 0.406: 53.47,38.48 53.47,35.43 53.47,31.5 v52.07,30.1 45.85,30.1 45.09,30.1 43.69,31.5 43.69,35.31 43.69,38.48 v44.96,39.75 49.02,39.75 50.16,39.75 52.2,39.75 53.47,38.48 | v56.01,42.42 54.61,41.02 54.61,39.62 53.47,38.48
3V3  (via drill 0.33)
  Top 0.152: U$1.2 30.65,37.51 30.23,37.08 | U$1.16 29.53,43.11 29.46,43.18 | U$1.30 28.6,45.95 28.7,45.85 | U$1.46 22.2,45.87 22.23,45.85 | U$1.62 21.32,42.31 21.46,42.16 | U$1.86 24.6,37.63 24.38,37.85 | U$1.37 25.8,45.87 25.78,45.85 | R1.1 32.13,25.02 C9.+ | R5.2 57.91,26.67 v54.61,29.97 | R4.2 51.56,28.96 | R6.1 6.99,33.78 4.57,36.2 | R7.1 13.65,25.72 12.06,27.3 12.06,31.11 JP2.2
  Top 0.406: 42.55,35.94 31.37,35.94 30.23,37.08 29.46,37.85 | 29.46,37.85 29.46,43.18 29.46,45.85 28.7,45.85 25.78,45.85 22.23,45.85 21.46,45.85 v21.46,42.29 21.46,42.16 21.46,37.85 24.38,37.85 29.46,37.85 | 42.55,35.94 v42.55,39.88 42.55,41.02 v51.05,41.02 v53.59,41.02 54.61,41.02 | 54.61,41.02 v54.61,34.54 v54.61,29.97 54.61,28.96 51.56,28.96 v47.12,28.96 v43.56,28.96 42.55,28.96 | 42.55,28.96 v42.55,34.54 42.55,35.94 | 42.55,35.94 44.64,35.94 C5.2 | v41.27,27.69 42.55,28.96 | 54.79,52.83 U$6.1 | 54.48,52.83 53.59,52.83 52.6,51.84 U$5.3 48.59,54.61 C8.2 47.94,56.07 46.86,57.15 44.2,57.15 43.18,58.17 U$3.3.3V | 54.61,52.83 54.79,52.83 | 54.79,52.83 54.86,52.83 | 55.12,52.83 54.86,52.83 | 54.86,52.83 54.74,52.7 54.61,52.7 54.48,52.83 | 54.48,52.83 54.61,52.83 | 54.61,52.83 54.61,41.02 | JP3.VCC 3.43,22.23 4.57,23.37 4.57,36.2 4.57,39.88 U$8.5
  Bottom 0.152: U$2.39 v54.61,34.55 v54.61,34.54 | U$2.50 55.03,29.05 54.61,29.46 v54.61,29.97 | U$2.74 43.05,28.44 v43.56,28.96 | U$2.66 47.05,28.88 v47.12,28.96 | U$2.100 42.14,41.05 42.55,40.64 v42.55,39.88 | U$2.87 v42.54,34.55 v42.55,34.54 | U$2.18 v51.05,41.03 v51.05,41.02 | U$2.24 54.05,41.47 v53.59,41.02
  Bottom 0.406: U$8.5 5.39,42.55 R3.1 5.78,42.87 6.35,42.29 v21.46,42.29 C3.2 | JP2.2 12.7,31.5 3.56,22.35 2.03,22.35 JP3.VCC | C9.+ 41.15,23.37 41.15,27.56 v41.27,27.69
5V0  (via drill 0.33)
  Top 0.406: U$4.3 40.13,51.84 | 40.13,51.84 39.52,51.84 38.1,50.42 38.1,46.74 v34.42,43.05 | 40.13,51.84 40.32,52.03 C2.1 40.32,59.37 U$3.5V
  Bottom 0.406: C11.+ 32,28.96 32,40.64 v34.42,43.05
A0
  Top 0.152: U$1.32 27.8,59.55 U$3.A0
A1
  Top 0.152: U$1.33 27.4,55.4 25.4,57.4 U$3.A1
A2
  Top 0.152: U$1.34 27,53.39 22.86,57.53 U$3.A2
A3
  Top 0.152: U$1.35 26.6,51.38 20.32,57.66 U$3.A3
A4
  Top 0.152: U$1.41 24.2,51.37 17.78,57.78 U$3.A4
A5
  Top 0.152: U$1.42 23.8,49.73 15.24,58.29 U$3.A5
D2
  Top 0.152: U$3.D2 20.32,12.45 9.4,23.37 9.4,44.32 14.48,49.4 20.59,49.4 U$1.50
D3
  Top 0.152: U$3.D3 22.86,12.57 22.23,13.21 20.07,13.21 9.78,23.5 9.78,44.2 12.29,46.71 U$1.51
D4
  Top 0.152: U$3.D4 25.4,13.21 24.89,13.72 20.07,13.72 10.16,23.62 10.16,44.07 12.4,46.31 U$1.52
D5
  Top 0.152: U$3.D5 27.94,13.59 27.43,14.1 20.19,14.1 10.54,23.75 10.54,43.94 12.51,45.91 U$1.53
D6
  Top 0.152: U$3.D6 30.48,13.97 29.97,14.48 20.32,14.48 10.92,24 10.92,37.59 13.24,39.91 U$1.68
D7
  Top 0.152: U$3.D7 33.02,14.35 32.51,14.86 20.45,14.86 11.3,24.26 11.3,37.47 13.35,39.51 U$1.69
D8
  Top 0.152: U$3.D8 36.83,11.94 16.51,32.26 16.51,38.61 17.02,39.12 U$1.70
D9
  Top 0.152: U$3.D9 39.37,12.06 35.43,16 34.16,16 22.99,27.18 22.1,27.18 16.89,32.38 16.89,38.1 17.5,38.71 U$1.71
D10  (via drill 0.33)
  Top 0.152: U$3.D10 36.96,16.38 34.29,16.38 22.86,27.81 v22.35,27.81 | 21.8,34.08 v21.97,33.91 21.4,34.48 U$1.78
  Bottom 0.152: v21.97,33.91 21.97,28.19 v22.35,27.81
D11  (via drill 0.33)
  Top 0.152: U$3.D11 39.12,16.76 34.42,16.76 v18.16,33.02 17.27,33.91 17.27,37.72 17.86,38.31 U$1.72
  Bottom 0.152: JP2.4 13.97,33.02 v18.16,33.02
D12  (via drill 0.33)
  Top 0.152: U$3.D12 41.27,17.14 34.54,17.14 19.56,32.13 v19.56,33.15 20.6,34.19 U$1.76
  Bottom 0.152: v19.56,33.15 18.16,31.75 JP2.1
D13  (via drill 0.33)
  Top 0.152: U$3.D13 43.43,17.53 34.67,17.53 28.13,24.07 | U$1.77 21,33.45 v20.7,33.15 20.7,31.5 28.13,24.07 | LED1.C 29.46,25.4 28.13,24.07
  Bottom 0.152: v20.7,33.15 19.56,34.29 JP2.3
GND  (via drill 0.33)
  other vias: 43.56,39.88 53.5,30.32 43.53,30.13 45.72,31.11 49.53,35.56 52.07,38.1 52.58,32.38 44.45,36.83 24.13,44.45 28.7,38.61 24.13,40.64 13.97,44.45 13.97,40.64 19.05,35.56 19.94,30.23 15.24,48.26 26.16,36.83 24.89,32.77 21.59,50.8 23.37,51.31 25.4,50.8 26.16,53.09 25.65,56.13 26.92,57.15 39.12,49.53 43.18,49.53 54.61,60.96 59.69,60.96 63.5,63.5 16.51,14.61 13.34,11.68 27.94,17.78 26.42,33.78 27.18,46.93 38.35,44.96 39.37,44.96 38.86,44.2 39.37,43.43 39.88,44.2 38.35,43.43 37.85,44.2 58.17,46.99 59.69,46.99 58.93,46.23 57.91,45.97 59.94,45.97 59.94,48.01 58.93,47.75 57.91,48.01 29.97,52.32 30.99,52.32 30.48,51.56 30.99,50.8 29.97,50.8 19.56,62.23 20.57,62.23 21.59,62.23 7.87,62.74 7.87,61.21 8.64,61.98 7.11,61.98 7.62,10.16 8.38,9.4 9.14,10.16 9.14,8.64 7.62,8.64 32.77,35.18 55.37,20.07 44.96,17.78 43.43,16.26 42.16,14.99 40.89,13.72 44.67,14.99 45.97,13.72 43.43,13.72 45.85,16.16 49.53,15.24 34.29,13.37 36.58,28.7 6.99,22.26 12.7,29.21 7.62,34.92 50.01,56.99 46.64,56.23 36.2,41.91
  pour Bottom: 0.64,70.48 0.64,0.64 70.48,0.64 70.48,70.48
  pour Top: 0.64,70.48 0.64,0.64 70.48,0.64 70.48,70.48
N$1
  Top 0.152: LED1.A 30.48,28.45 31.3,28.45 R1.2
N$2
  Top 0.152: U$1.85 24.2,34.47 C7.1
N$3
  Top 0.152: LED2.C R2.2
N$4
  Top 0.152: TX.A 16.43,27.54 R7.2
N$5
  Top 0.152: R6.2 RX.A
PGEC  (via drill 0.33)
  Top 0.152: U$1.24 31.2,46.31 30.99,46.1 30.99,45.59 v30.48,45.09
  Bottom 0.152: U$8.2 5.84,34.92 9.91,38.99 26.92,38.99 29.08,41.15 29.08,43.69 v30.48,45.09
PGED  (via drill 0.33)
  Top 0.152: U$1.25 30.71,46.71 v30.48,46.48
  Bottom 0.152: U$8.3 7.75,37.47 9.78,39.5 26.67,39.5 28.7,41.53 28.7,44.7 v30.48,46.48
PMA1  (via drill 0.33)
  Top 0.152: U$1.43 23.4,47.47 23.62,47.24 v24.13,47.24
  Bottom 0.152: U$2.97 39.58,39.55 36.2,42.93 36.2,44.07 35.31,44.96 35.05,44.96 34.54,45.47 34.54,45.85 32.89,47.5 24.38,47.5 v24.13,47.24
PMA2  (via drill 0.33)
  Top 0.152: U$1.14 34.14,42.31 35.31,41.15 v35.69,41.15
  Bottom 0.152: U$2.96 39.44,39.05 37.34,41.15 v35.69,41.15
PMA3  (via drill 0.33)
  Top 0.152: U$1.12 34.05,41.51 35.18,40.39 v36.32,40.39
  Bottom 0.152: U$2.95 39.05,38.55 37.21,40.39 v36.32,40.39
PMA4  (via drill 0.33)
  Top 0.152: U$1.11 33.69,41.11 35.18,39.62 v35.69,39.62
  Bottom 0.152: U$2.94 38.66,38.05 37.08,39.62 v35.69,39.62
PMA5  (via drill 0.33)
  Top 0.152: U$1.10 33.33,40.71 35.05,38.99 v36.32,38.99
  Bottom 0.152: U$2.93 38.4,37.55 36.96,38.99 v36.32,38.99
PMA6  (via drill 0.33)
  Top 0.152: U$1.29 29,47.71 29.21,47.5 33.53,47.5 v35.31,45.72
  Bottom 0.152: U$2.98 39.71,40.05 36.58,43.18 36.58,44.45 v35.31,45.72
PMD0  (via drill 0.33)
  Top 0.152: U$1.93 27.4,34.07 28.96,32.51 v36.32,32.51
  Bottom 0.152: U$2.82 38.19,32.05 37.72,32.51 v36.32,32.51
PMD1  (via drill 0.33)
  Top 0.152: U$1.94 27.8,34.3 28.96,33.15 v35.69,33.15
  Bottom 0.152: U$2.83 38.45,32.55 37.85,33.15 v35.69,33.15
PMD2  (via drill 0.33)
  Top 0.152: U$1.98 29.4,34.1 29.72,33.78 v36.32,33.78
  Bottom 0.152: U$2.84 38.71,33.05 37.97,33.78 v36.32,33.78
PMD3  (via drill 0.33)
  Top 0.152: U$1.99 29.8,34.34 29.97,34.16 34.04,34.16 34.29,34.42 v35.69,34.42
  Bottom 0.152: U$2.85 38.97,33.55 38.1,34.42 v35.69,34.42
PMD4  (via drill 0.33)
  Top 0.152: U$1.100 30.24,35.29 30.99,34.54 33.78,34.54 34.29,35.05 36.08,35.04 v36.32,35.05
  Bottom 0.152: U$2.86 39.36,34.05 38.35,35.05 v36.32,35.05
PMD5  (via drill 0.33)
  Top 0.152: U$1.3 33.46,37.91 34.54,36.83 v35.69,36.83
  Bottom 0.152: U$2.90 36.47,36.05 v35.69,36.83
PMD6  (via drill 0.33)
  Top 0.152: U$1.4 33.83,38.31 34.54,37.59 v36.32,37.59
  Bottom 0.152: U$2.91 37.37,36.55 v36.32,37.59
PMD7  (via drill 0.33)
  Top 0.152: U$1.5 34.31,38.71 34.8,38.23 v35.69,38.23
  Bottom 0.152: U$2.92 38.01,37.05 36.83,38.23 v35.69,38.23
PMRW  (via drill 0.33)
  Top 0.152: U$1.82 23,33.64 25.02,31.62 35.43,31.62 v35.69,31.88
  Bottom 0.152: U$2.81 37.92,31.55 37.59,31.88 v35.69,31.88
PMSTB  (via drill 0.33)
  Top 0.152: U$1.81 22.6,33.28 24.64,31.24 v36.32,31.24
  Bottom 0.152: U$2.80 37.79,31.05 37.59,31.24 v36.32,31.24
REFO  (via drill 0.33)
  Top 0.152: U$1.44 23,46.88 v22.99,46.86
  Bottom 0.152: v22.99,46.86 23.5,46.35 29.08,46.35 29.84,47.12 32.77,47.12 33.15,46.74 33.15,45.72 35.31,43.56 35.31,42.55 34.67,41.91 34.67,30.99 35.05,30.61 v35.66,30.61 35.72,30.55 U$2.79
RST  (via drill 0.33)
  Top 0.152: U$1.13 v30.48,41.91 | U$3.RES 47.24,58.17 49.02,58.17 49.53,58.67 49.53,61.21 51.31,62.99 53.09,62.99 53.59,63.5 53.59,66.04 49.53,70.1 11.43,70.1 5.33,64.01 5.33,58.67 7.11,56.9 7.11,54.61 2.03,49.53 2.03,45.21 U$8.6 | S1.3 6.88,18.52 5.59,19.81 v5.59,34.04
  Bottom 0.152: 15.24,38.48 10.03,38.48 v5.59,34.04 5.21,33.66 1.27,33.66 0.64,34.29 0.64,43.94 1.78,45.09 U$8.6 2.23,44.77 R3.2 | 15.24,38.48 27.05,38.48 v30.48,41.91 | JP2.5 15.24,38.48
RX
  Top 0.152: 8.64,24.77 8.64,23.11 15.24,16.51 U$3.RX 14.48,10.67 10.67,10.67 10.16,11.18 10.16,13.46 3.94,19.68 JP3.TXO | 8.64,24.77 8.64,44.58 14.22,50.16 21.08,50.16 21.4,49.85 U$1.48 | RX.C 8.41,24.54 8.64,24.77
SCL  (via drill 0.33)
  Top 0.152: U$1.96 28.6,36.73 v28.7,36.83 | v30.73,30.48 34.8,30.48 35.81,29.46 37.85,29.46 47.24,20.07 47.24,18.03 48.77,16.51 54.61,16.51 U$3.SCL
  Bottom 0.152: v28.7,36.83 28.7,32.51 v30.73,30.48
SDA  (via drill 0.33)
  Top 0.152: U$1.95 28.2,36.32 28.19,36.32 27.94,36.32 v27.43,36.83 | v28.45,30.23 28.96,29.72 33.27,29.72 35.56,27.69 37.59,27.69 45.72,19.56 45.72,17.27 48.51,14.48 54.1,14.48 U$3.SDA
  Bottom 0.152: v27.43,36.83 27.43,31.24 v28.45,30.23
TCK
  Bottom 0.152: U$2.47 57.85,30.55 59.18,29.21 JP1.1
TDI  (via drill 0.33)
  Top 0.152: v52.83,17.53 50.55,17.53 50.29,17.78 50.29,20.07 JP1.9
  Bottom 0.152: U$2.48 57.59,30.05 58.67,28.96 58.67,24.64 57.91,23.88 57.91,18.03 57.4,17.53 v52.83,17.53
TDO
  Bottom 0.152: U$2.54 53.05,25.19 54.1,24.13 54.1,23.88 JP1.3
TMS  (via drill 0.33)
  Top 0.152: JP1.5 54.1,24.13 v55.37,25.4
  Bottom 0.152: U$2.49 57.32,29.55 57.91,28.96 57.91,26.67 56.64,25.4 v55.37,25.4
TRST  (via drill 0.33)
  Top 0.152: JP1.8 52.83,20.07 v52.83,24.38
  Bottom 0.152: U$2.55 52.55,24.67 v52.83,24.38
TX  (via drill 0.33)
  Top 0.152: U$1.49 21,49.61 20.83,49.78 14.35,49.78 9.02,44.45 9.02,23.24 17.78,14.48 U$3.TX 16.26,9.91 10.41,9.91 9.4,10.92 9.4,13.21 5.46,17.14 JP3.RXI | TX.C v13.97,22.86
  Bottom 0.152: v13.97,22.86 13.97,15.24 U$3.TX
VJTAG
  Top 0.152: R5.1 57.91,18.03 57.4,17.53 55.37,17.53 JP1.6
  Bottom 0.152: U$2.56 52.05,24.16 52.83,23.37 52.83,20.07 JP1.6
VPUMP  (via drill 0.33)
  Top 0.152: JP1.7 51.56,24.38 | 51.56,24.38 52.58,25.4 v54.1,25.4 | R4.1 51.56,24.61 51.56,24.38
  Bottom 0.152: U$2.52 54.05,25.46 v54.1,25.4
VRAW  (via drill 0.33)
  Top 0.813: C1.1 32.7,59.38 U$3.VIN | J1.PWR 9.91,55.26 9.91,58.42 16.26,64.77 X1.13 19,65.94 X1.25 22.15,69.09 49.02,69.09 50.75,67.36 X1.14 52.12,65.94 X1.1 | X2.13 65.94,52.12 X2.25 67.36,50.75 69.09,49.02 69.09,22.15 X2.14 65.94,19 X2.1 | X3.13 52.12,5.18 X3.25 48.72,1.78 22.35,1.78 20.37,3.76 X3.14 19,5.18 X3.1
  Top 1.016: J1.PWR 13.97,55.24 C10.+ | U$5.1 50.65,47.22 50.04,46.61 v42.93,46.61 41.81,46.61 U$4.1 | C1.1 v31.5,54.61
  Bottom 0.813: X2.13 64.77,54.1 62.23,56.64 62.23,60.2 60.2,62.23 56.64,62.23 54.1,64.77 X1.1 | X2.1 64.77,17.02 62.48,14.73 62.48,9.91 61.21,8.64 56.39,8.64 54.1,6.35 X3.13
  Bottom 1.016: C10.+ v31.5,54.61 34.67,54.61 38.1,51.18 38.1,48.9 40.39,46.61 v42.93,46.61
XA3
  Bottom 0.152: U$2.23 53.55,44.15 53.59,44.2 53.59,63.25 53.55,63.3 53.34,63.5 47.88,63.5 X1.3
XA4
  Bottom 0.152: U$2.21 52.55,44.42 52.58,44.45 52.58,62.23 52.55,62.26 52.32,62.48 45.21,62.48 43.84,63.86 X1.4
XA5
  Bottom 0.152: U$2.19 51.55,45.2 51.56,45.21 51.56,56.64 51.55,56.66 49.53,58.67 49.53,60.96 48.9,61.59 46.29,61.59 46.16,61.47 43.94,61.47 41.07,64.34 X1.5
XA6
  Bottom 0.152: U$2.15 49.55,44.21 50.55,45.21 50.56,54.34 46.74,57.91 45.47,57.91 44.45,58.93 44.45,60.71 44.2,60.96 42.14,60.96 X1.6
XA7  (via drill 0.33)
  Top 0.152: v41.91,57.4 41.91,60.45 39.12,63.25 37.08,63.25 X1.7
  Bottom 0.152: U$2.11 47.55,43.73 49.53,45.72 49.53,50.29 42.42,57.4 v41.91,57.4
XA8  (via drill 0.33)
  Top 0.152: v39.37,57.66 39.37,62.23 38.86,62.74 34.82,62.74 X1.8
  Bottom 0.152: U$2.8 46.05,43.76 48.51,46.23 48.51,49.78 42.16,56.13 40.89,56.13 v39.37,57.66
XA9  (via drill 0.33)
  Top 0.152: v36.83,58.17 36.83,61.21 35.81,62.23 32.59,62.23 X1.9
  Bottom 0.152: U$2.6 45.05,44.28 47.5,46.74 47.5,49.28 41.66,55.12 39.88,55.12 v36.83,58.17
XA10  (via drill 0.33)
  Top 0.152: v34.29,58.17 34.29,61.47 34.04,61.72 30.33,61.72 X1.10
  Bottom 0.152: U$2.4 44.05,44.81 46.48,47.24 46.48,48.51 41.15,54.1 38.35,54.1 v34.29,58.17
XA11
  Bottom 0.152: U$2.2 43.05,45.33 45.47,47.75 45.47,48.26 40.64,53.09 37.59,53.09 33.78,56.9 33.02,56.9 27.18,62.74 26.54,62.74 X1.11
XA16
  Bottom 0.152: U$2.22 53.05,44.41 53.09,44.45 53.09,62.74 53.05,62.78 52.83,62.99 46.23,62.99 45.21,64.01 X1.16
XA17
  Bottom 0.152: U$2.20 52.05,44.93 52.07,44.96 52.07,61.72 52.05,61.75 51.82,61.98 44.45,61.98 42.42,64.01 42.42,67.26 X1.17
XA18  (via drill 0.33)
  Top 0.152: v46.74,60.96 42.93,60.96 39.7,64.19 X1.18
  Bottom 0.152: U$2.16 50.05,43.95 51.05,44.96 51.05,54.61 46.99,58.67 46.99,60.71 v46.74,60.96
XA19
  Bottom 0.152: U$2.13 48.55,43.97 50.04,45.47 50.04,50.55 41.91,58.67 41.91,60.45 39.12,63.25 37.85,63.25 36.93,64.16 X1.19
XA20
  Bottom 0.152: U$2.10 47.05,44 49.02,45.97 49.02,50.04 42.47,56.59 41.46,56.59 39.37,58.67 39.37,62.23 38.86,62.74 35.56,62.74 34.19,64.11 X1.20
XA21
  Bottom 0.152: U$2.7 45.55,44.02 48.01,46.48 48.01,49.53 41.91,55.63 40.39,55.63 36.83,59.18 36.83,61.21 35.81,62.23 33.53,62.23 31.42,64.34 X1.21
XA22
  Bottom 0.152: U$2.5 44.55,44.55 46.99,46.99 46.99,48.77 41.5,54.52 41.4,54.61 38.86,54.61 34.29,59.18 34.29,61.47 34.04,61.72 31.5,61.72 28.65,64.57 X1.22
XA23
  Bottom 0.152: U$2.3 43.55,45.07 45.97,47.5 45.97,48.51 40.89,53.59 38.1,53.59 34.29,57.4 33.53,57.4 27.69,63.25 27.18,63.25 25.91,64.52 X1.23
XB3
  Bottom 0.152: X2.3 64.77,24.64 57.86,31.55 U$2.45
XB4
  Bottom 0.152: U$2.43 59.51,32.55 X2.4
XB5
  Bottom 0.152: U$2.41 60.69,33.55 64.19,30.05 X2.5
XB6
  Bottom 0.152: U$2.36 60.22,36.05 63.48,32.79 X2.6
XB7
  Bottom 0.152: U$2.34 61,37.05 62.48,35.56 X2.7
XB8
  Bottom 0.152: U$2.32 61.67,38.05 61.95,38.33 X2.8
XB9
  Bottom 0.152: U$2.30 58.35,39.05 60.38,41.07 X2.9
XB10
  Bottom 0.152: U$2.28 57.83,40.05 61.62,43.84 X2.10
XB11
  Bottom 0.152: U$2.26 57.3,41.05 62.87,46.61 X2.11
XB16
  Bottom 0.152: X2.16 64.52,25.91 58.38,32.05 U$2.44
XB17
  Bottom 0.152: U$2.42 59.92,33.05 64.31,28.65 X2.17
XB18
  Bottom 0.152: U$2.40 61.2,34.05 63.83,31.42 X2.18
XB19
  Bottom 0.152: U$2.35 60.48,36.55 62.84,34.19 X2.19
XB20
  Bottom 0.152: U$2.33 61.52,37.55 62.13,36.93 X2.20
XB21
  Top 0.152: LED2.A 61.11,39.85 61.28,39.7 X2.21
  Bottom 0.152: U$2.31 58.61,38.55 59.77,39.7 X2.21
XB22
  Bottom 0.152: U$2.29 58.09,39.55 61.01,42.47 X2.22
XB23
  Bottom 0.152: U$2.27 57.56,40.55 62.23,45.21 X2.23
XC3  (via drill 0.33)
  Top 0.152: v24.13,13.05 24.13,6.73 X3.3
  Bottom 0.152: U$2.78 39.7,30.05 38.86,29.21 38.86,25.4 38.1,24.64 36.58,24.64 26.42,14.48 25.56,14.48 v24.13,13.05
XC4  (via drill 0.33)
  Top 0.152: v26.67,13.21 26.67,6.96 X3.4
  Bottom 0.152: U$2.76 40.48,29.05 39.88,28.45 39.87,24.88 38.61,23.62 37.05,23.62 v26.67,13.21
XC5  (via drill 0.33)
  Top 0.152: v29.21,13.21 29.21,7.19 X3.5
  Bottom 0.152: U$2.72 44.05,26.27 42.16,24.38 42.16,21.59 36.32,15.75 31.75,15.75 v29.21,13.21
XC6  (via drill 0.33)
  Top 0.152: v31.75,13.21 31.75,7.39 X3.6
  Bottom 0.152: U$2.70 45.05,26 43.18,24.13 43.18,21.08 36.83,14.73 33.27,14.73 v31.75,13.21
XC7
  Bottom 0.152: U$2.65 47.55,26.21 47.37,26.04 46.61,26.04 44.2,23.62 44.2,20.57 37.34,13.72 35.81,13.72 34.54,12.45 34.54,7.37 X3.7
XC8
  Bottom 0.152: U$2.63 48.55,25.43 48.26,25.15 47.24,25.15 45.21,23.11 45.21,20.07 37.85,12.7 36.32,12.7 35.56,11.94 35.56,10.16 38.33,7.39 X3.8
XC9
  Bottom 0.152: U$2.61 49.55,24.4 49.28,24.13 47.75,24.13 46.23,22.61 46.23,17.78 40.64,12.19 40.64,6.78 X3.9
XC10
  Bottom 0.152: U$2.59 50.55,23.88 49.78,23.11 48.26,23.11 47.24,22.1 47.24,13.46 45.72,11.94 45.72,8.23 X3.10
XC11
  Bottom 0.152: U$2.57 51.55,23.1 50.29,21.84 50.29,12.7 50.8,12.19 50.8,10.54 X3.11
XC16
  Bottom 0.152: U$2.77 39.7,29.55 39.37,29.21 39.37,25.15 38.35,24.13 36.83,24.13 26.67,13.97 26.16,13.97 24.13,11.94 24.13,10.67 25.91,8.89 X3.16
XC17
  Bottom 0.152: U$2.73 43.55,26.27 41.66,24.38 41.66,21.84 36.07,16.26 30.99,16.26 26.67,11.94 26.67,9.65 28.65,7.67 X3.17
XC18
  Bottom 0.152: U$2.71 44.55,26.26 42.67,24.38 42.67,21.34 36.58,15.24 32.51,15.24 29.21,11.94 29.21,9.14 31.42,6.93 X3.18
XC19
  Bottom 0.152: U$2.69 45.55,25.73 43.69,23.88 43.69,20.83 37.08,14.22 33.78,14.22 31.75,12.19 31.75,9.4 34.19,6.96 X3.19
XC20
  Bottom 0.152: U$2.64 48.05,25.69 48.01,25.65 46.99,25.65 44.7,23.37 44.7,20.32 37.59,13.21 36.07,13.21 35.05,12.19 35.05,9.91 36.93,8.03 X3.20
XC21
  Bottom 0.152: U$2.62 49.05,24.91 48.77,24.64 47.5,24.64 45.72,22.86 45.72,19.81 38.1,12.19 38.1,8.64 39.7,7.04 X3.21
XC22
  Bottom 0.152: U$2.60 50.05,24.14 49.53,23.62 48.01,23.62 46.74,22.35 46.74,15.75 43.18,12.19 43.18,7.87 42.47,7.16 X3.22
XC23
  Bottom 0.152: U$2.58 51.05,23.61 50.04,22.61 48.51,22.61 47.75,21.84 47.75,12.45 48.26,11.94 48.26,9.65 45.21,6.6 X3.23

### Text on the board
tNames: 2 | 3 | 4 | 5 | 6 | 7 | 8 | 10 | 11 | 13 | 15 | 16 | 19 | 20 | 21 | 22 | 23 | VREG 1.5 | VREG 5.0 | VREG 3.3 | PMA0 | 98 | RST | PMA1 | 97 | 26 | 27 | 28 | 3.3v | SuperDuino | 29 | GND | PMA2 | 96 | Derek Schacht | 30 | PMA3 | 95 | PMA4 | PMA5 | 93 | 94 | 20160206 | 31 | PGED | PMD7 | 92 | 32 | PMD5 | PMD6 | 90 | 91 | 33 | PGEC | PMD4 | 86 | 34 | PIC ICSP | PMD2 | PMD3 | 84 | 85 | 35 | PMD1 | 83 | 36 | D_RW | PMD0 | 81 | 82 | DSTB | 80 | 40 | RCLK | 79 | 41 | BLK | 42 | 43 | GND | 44 | 45 | TDI | VPMP | TMS | TDO | TCK | 3V3 | RESET | RX | TX | TRST | VJTG | NC | FTDI SERIAL | GRN | 78 | 77 | 76 | 73 | 72 | 71 | 70 | 69 | 65 | 64 | 63 | 62 | 61 | 60 | 59 | 58 | 57